# Altium project GSMBoard_SIM900.PrjPcb
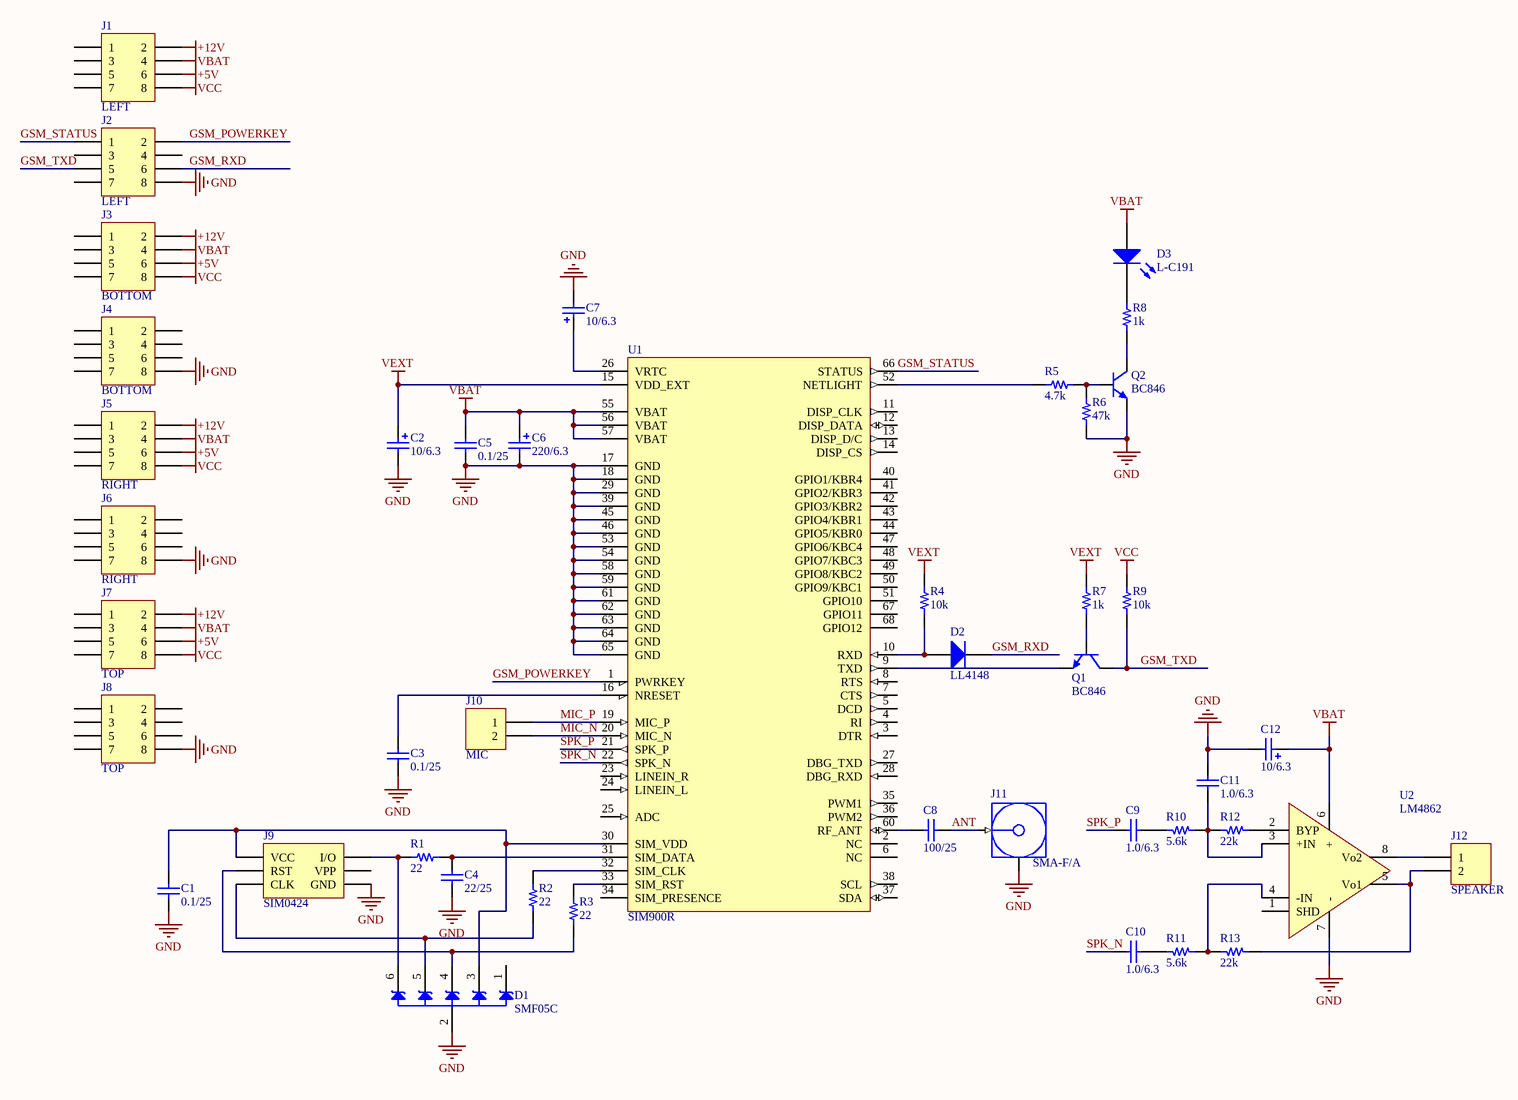
[diagram p0: GSMBoard_SIM900.SchDoc]
1 sheet, 44 parts. Net scope: global (net labels, ports and power ports of the same name join across sheets).
Board file: GSMBoard_SIM900.PcbDoc

## Sheet GSMBoard_SIM900.SchDoc
size A3

### Parts
C1  0.1/25  [CAP0402]
C2  10/6.3  [SMA]
C3  0.1/25  [CAP0402]
C4  22/25  [CAP0402]
C5  0.1/25  [CAP0402]
C6  220/6.3  [SMC]
C7  10/6.3  [SMA]
C8  100/25  [CAP0402]
C9  1.0/6.3  [CAP0402]
C10  1.0/6.3  [CAP0402]
C11  1.0/6.3  [CAP0402]
C12  10/6.3  [SMA]
D1  SMF05C  [SOT363]
D2  LL4148  [SOD80]
D3  L-C191  [LED0603]
J1  LEFT  [PBDM-8]
J2  LEFT  [PBDM-8]
J3  BOTTOM  [PBDM-8]
J4  BOTTOM  [PBDM-8]
J5  RIGHT  [PBDM-8]
J6  RIGHT  [PBDM-8]
J7  TOP  [PBDM-8]
J8  TOP  [PBDM-8]
J9  SIM0424  [SIM0424]
J10  MIC  [PLS-2R]
J11  SMA-F/A  [SMA-F/A]
J12  SPEAKER  [PLS-2R]
Q1  BC846  [SOT23]
Q2  BC846  [SOT23]
R1  22  [RES0402]
R2  22  [RES0402]
R3  22  [RES0402]
R4  10k  [RES0402]
R5  4.7k  [RES0402]
R6  47k  [RES0402]
R7  1k  [RES0402]
R8  1k  [RES0402]
R9  10k  [RES0402]
R10  5.6k  [RES0402]
R11  5.6k  [RES0402]
R12  22k  [RES0402]
R13  22k  [RES0402]
U1  SIM900R  [SIM900_quad68]
U2  LM4862  [SO8]

### Nets
+5V: J1.6 J3.6 J5.6 J7.6
+12V: J1.2 J3.2 J5.2 J7.2
GND: C1.1 C2.1 C3.1 C4.1 C5.1 C6.1 C7.1 C11.1 C12.1 D1.2 J2.8 J4.8 J6.8 J8.8 J9.4(GND) J11.2(GND) Q2.2 R6.2 U1.17(GND) U1.18(GND) U1.29(GND) U1.39(GND) U1.45(GND) U1.46(GND) U1.53(GND) U1.54(GND) U1.58(GND) U1.59(GND) U1.61(GND) U1.62(GND) U1.63(GND) U1.64(GND) U1.65(GND) U2.7(-)
VBAT: C5.2 C6.2 C12.2 D3.2 J1.4 J3.4 J5.4 J7.4 U1.55(VBAT) U1.56(VBAT) U1.57(VBAT) U2.6(+)
VCC: J1.8 J3.8 J5.8 J7.8 R9.1
VEXT: C2.2 R4.1 R7.1 U1.15(VDD_EXT)
ANT: C8.2 J11.1(Signal)
GSM_POWERKEY: J2.2 U1.1(PWRKEY)
GSM_RXD: D2.1 J2.6
GSM_STATUS: J2.1 U1.66(STATUS)
GSM_TXD: J2.5 Q1.3 R9.2
MIC_N: J10.2 U1.20(MIC_N)
MIC_P: J10.1 U1.19(MIC_P)
SPK_N: C10.1 U1.22(SPK_N)
SPK_P: C9.1 U1.21(SPK_P)
NetC1_2: C1.2 D1.3 J9.1(VCC) U1.30(SIM_VDD)
NetC3_2: C3.2 U1.16(NRESET)
NetC4_2: C4.2 R1.1 U1.31(SIM_DATA)
NetC7_2: C7.2 U1.26(VRTC)
NetC8_1: C8.1 U1.60(RF_ANT)
NetC9_2: C9.2 R10.2
NetC10_2: C10.2 R11.2
NetC11_2: C11.2 R10.1 R12.2 U2.3(+IN)
NetD1_4: D1.4 J9.2(RST) R3.2
NetD1_5: D1.5 J9.3(CLK) R2.2
NetD1_6: D1.6 J9.6(I/O) R1.2
NetD2_2: D2.2 R4.2 U1.10(RXD)
NetD3_1: D3.1 R8.1
NetJ12_1: J12.1 U2.8(Vo2)
NetJ12_2: J12.2 R13.1 U2.5(Vo1)
NetQ1_1: Q1.1 R7.2
NetQ1_2: Q1.2 U1.9(TXD)
NetQ2_1: Q2.1 R5.1 R6.1
NetQ2_3: Q2.3 R8.2
NetR2_1: R2.1 U1.32(SIM_CLK)
NetR3_1: R3.1 U1.33(SIM_RST)
NetR5_2: R5.2 U1.52(NETLIGHT)
NetR11_1: R11.1 R13.2 U2.4(-IN)
NetR12_1: R12.1 U2.2(BYP)

Not connected (* = marked no-connect by the designer): D1 1; J1 1 3 5 7; J2 3 4 7; J3 1 3 5 7; J4 1 2 3 4 5 6 7; J5 1 3 5 7; J6 1 2 3 4 5 6 7; J7 1 3 5 7; J8 1 2 3 4 5 6 7; J9 5(VPP); U1 2(NC) 3(DTR) 4(RI) 5(DCD) 6(NC) 7(CTS) 8(RTS) 11(DISP_CLK) 12(DISP_DATA) 13(DISP_D/C) 14(DISP_CS) 23(LINEIN_R) 24(LINEIN_L) 25(ADC) 27(DBG_TXD) 28(DBG_RXD) 34(SIM_PRESENCE) 35(PWM1) 36(PWM2) 37(SDA) 38(SCL) 40(GPIO1/KBR4) 41(GPIO2/KBR3) 42(GPIO3/KBR2) 43(GPIO4/KBR1) 44(GPIO5/KBR0) 47(GPIO6/KBC4) 48(GPIO7/KBC3) 49(GPIO8/KBC2) 50(GPIO9/KBC1) 51(GPIO10) 67(GPIO11) 68(GPIO12); U2 1(SHD)

### Notes on the sheet
- Title
- Size:
- Date:
- A3
- Number:
- Time:
- Revision:
- Sheet
- of
- File:

### Library data of the parts
C1 C3 C5 = CAP0402: Ceramic chip capacitor 0402; Value: 0.1; Voltage: 25; PartNumber: CAP0402; Category: Capacitor; Author: oiezhov
C2 C7 C12 = TAJA: Standard tantalum SMT capacitor, size A; PartNumber: TAJA; Value: 10; Voltage: 6.3; Category: Capacitor; ComponentLink1Description: Datasheet; ComponentLink1URL: d:\_AltiumLibs\Pdf\Passive\Capacitors\TAJ - AVX.pdf; Author: oiezhov
C4 = CAP0402: Ceramic chip capacitor 0402; Value: 22; Voltage: 25; PartNumber: CAP0402; Category: Capacitor; Author: oiezhov
C6 = TAJC: Standard tantalum SMT capacitor, size C; PartNumber: TAJC; Value: 220; Voltage: 6.3; Category: Capacitor; ComponentLink1Description: Datasheet; ComponentLink1URL: d:\_AltiumLibs\Pdf\Passive\Capacitors\TAJ - AVX.pdf; Author: oiezhov
C8 = CAP0402: Ceramic chip capacitor 0402; Value: 100; Voltage: 25; PartNumber: CAP0402; Category: Capacitor; Author: oiezhov
C9-C11 = CAP0402: Ceramic chip capacitor 0402; Value: 1.0; Voltage: 6.3; PartNumber: CAP0402; Category: Capacitor; Author: oiezhov
D1 = SMF05C: 5-line TVS Array for ESD and Latch-Up Protection; WorkingVoltage: 5; PartNumber: SMF05C; Category: Transient Voltage Suppressor; ComponentLink1Description: Datasheet; ComponentLink1URL: d:\_AltiumLibs\Pdf\Discrete\TransientVoltageSuppressor\SMFxxC.PDF; Author: oiezhov
D2 = LL4148: Small Signal Diode; PartNumber: LL4148; Category: Diode; ComponentLink1Description: Datasheet; ComponentLink1URL: d:\_AltiumLibs\Pdf\Discrete\Diode\LL4148.pdf; Author: oiezhov
D3 = L-C191: SMD LED, size 0603; PartNumber: L-C191; Category: Optical; ComponentLink1Description: Datasheet; ComponentLink1URL: d:\_AltiumLibs\Pdf\Optical\L-C191YCT.pdff; Author: oiezhov
J1-J8 = PBDM-8: 2x4-pin header, pitch 2.54 mm; PartNumber: PBDM-8; Category: Connector; ComponentLink1Description: Datasheet; ComponentLink1URL: d:\_AltiumLibs\Pdf\Mechanical\Connector\pbsm.pdf; Author: oiezhov
J9 = SIM0424: 6-pin SIM card holder; PartNumber: SIM0424; Category: Connector; ComponentLink1Description: Datasheet; ComponentLink1URL: sim0424 - sim card holder.pdf; Author: oiezhov
J10 J12 = PLS-2R: 2-pin angle header, pitch 2.54 mm; PartNumber: PLS-2R; Category: Connector; ComponentLink1Description: Datasheet; ComponentLink1URL: d:\_AltiumLibs\Pdf\Mechanical\Connector\PLS, PLD.pdf; Author: oiezhov
J11 = SMA-F/A: Angle SMA female connector; PartNumber: SMA-F/A; Category: Connector; Author: oiezhov
Q1 Q2 = BC846: NPN Silicon AF Transistor; PartNumber: BC846; Category: Transistor; ComponentLink1Description: Datasheet; ComponentLink1URL: d:\_AltiumLibs\Pdf\Discrete\Transistor\BC846-BC850.pdf; Author: oiezhov
R1-R13 = RES0402: Ceramic chip resistor; PartNumber: RES0402; Category: Resistor; Author: oiezhov
  R1-R3: Value: 22
  R4 R9: Value: 10k
  R5: Value: 4.7k
  R6: Value: 47k
  R7 R8: Value: 1k
  R10 R11: Value: 5.6k
  R12 R13: Value: 22k
U1 = SIM900R: GSM module; 2G; 1800MHz,900MHz; 85.6kbps; I2C, UART; 3.4A@4.5VDC; PartNumber: SIM900R; Category: IC/GSM/GPRS; ComponentLink1Description: Datasheet; ComponentLink1URL: d:\_AltiumLibs\Pdf\IC\GsmGprs\SIM900x\SIM900R_HardwareDesign_v1_00_2.pdf; Author: oiezhov; ComponentLink2Description: AT command manual; ComponentLink2URL: d:\_AltiumLibs\Pdf\IC\GsmGprs\SIM900x\SIM900x_ATCommandManual_v1.03.pdf; ComponentLink3Description: Reference design; ComponentLink3URL: d:\_AltiumLibs\Pdf\IC\GsmGprs\SIM900x\SIM900_ReferenceDesignGuide_v1.02.pdf
U2 = LM4862: Audio Power Amplifier with Shutdown Mode; PartNumber: LM4862; Category: IC/Amp; ComponentLink1Description: Datasheet; ComponentLink1URL: d:\_AltiumLibs\Pdf\IC\Amp\LM4862.pdf; Author: oiezhov